# EAGLE design OSO-MISC-20-009 Power Adapter for Sensor Cap (EAGLE 9.4.2)
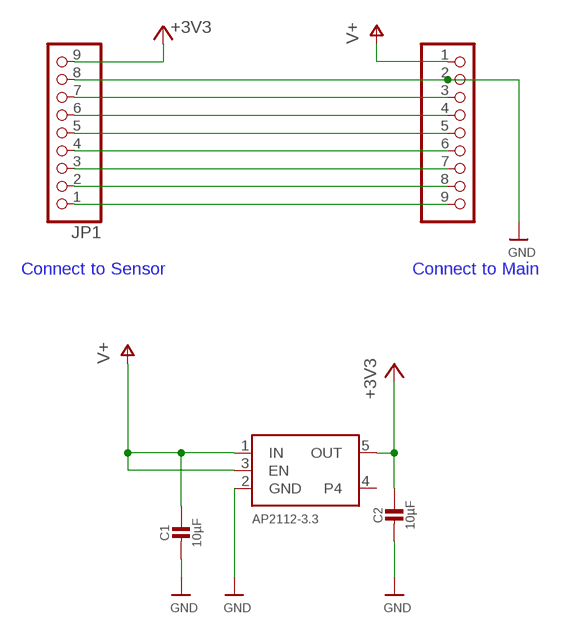
[diagram p0: schematic, sheet 1]

## Parts
C1  10µF  CAP_CERAMIC0805-NOOUTLINE  [0805-NO]
C2  10µF  CAP_CERAMIC0805-NOOUTLINE  [0805-NO]
JP1  HEADER-1X9_JSTSH  [JST_SH9]
JP2  HEADER-1X9_JSTSH  [JST_SH9]
U1  AP2112-3.3  VREG_SOT23-5  [SOT23-5]

## Nets
+3V3 [power]: C2.1 JP1.9 U1.5(OUT)
GND [gnd]: C1.2 C2.2 JP1.8 JP2.2 U1.2(GND)
N$1: JP1.1 JP2.9
N$2: JP1.2 JP2.8
N$3: JP1.3 JP2.7
N$4: JP1.4 JP2.6
N$5: JP1.5 JP2.5
N$6: JP1.6 JP2.4
N$7: JP1.7 JP2.3
V+ [power]: C1.1 JP2.1 U1.1(IN) U1.3(EN)
Unconnected: U1.4

## Notes on the sheet
- Connect to Sensor | Connect to Main

## Library data of the parts
C1 C2 = microbuilder:CAP_CERAMIC: Ceramic Capacitors For new designs, use the packages preceded by an '_' character since they are more reliable: The following footprints should be used on most boards: _0402 - Standard footprint for regular board layouts _0603 - Standard footprint for regular board layouts _0805 - Standard footprint for regular board layouts _1206 - Standard footprint for regular board layouts For extremely tight-pitch boards where space is at a premium, the following 'micro-pitch' footprints can be used (smaller pads, no silkscreen outline, etc.): _0402MP - Micro-pitch footprint for very dense/compact boards _0603MP - Micro-pitch footprint for very dense/compact boards _0805MP - Micro-pitch footprint for very dense/compact boards _1206MP - Micro-pitch footprint for very dense/compact boards
JP1 JP2 = microbuilder:HEADER-1X9: PIN HEADER
U1 = microbuilder:VREG_SOT23-5: SOT23-5 Fixed Voltage Regulators Part Current Out V Out V In V Dropout θJA (°C/W) TJ (°C) Digikey Part No. ADP121 150mA 3.3V 3.4-5.5V 0.09V @ 150mA -- -- ADP121-AUJZ33R7CT-ND ADP121 150mA 3.0V 3.1-5.5V 0.09V @ 150mA -- -- ADP121-AUJZ30R7CT-ND ADP122 300mA 3.3V 3.4-5.5V 0.085V @ 300mA -- -- ADP122AUJZ-3.3-R7CT-ND ADP1712 300mA 3.3V 3.5-5.5V 0.17V @ 300mA -- -- ADP1712AUJZ-3.3-R7TR-ND AP7311 (Low Cost) 150mA 3.3V 3.5-6V 0.15V @ 150mA -- -- AP7311-33WG-7DICT-ND LD39015M18R 150mA 1.8V 1.9V-5.5V 0.08V @ 100mA -- -- 497-6977-1-ND LP2985A-33DBVR 150mA 3.3V 3.3-16V 0.28V @ 150mA 206 150 296-18479-1-ND MCP1824T-3302E/OT 300mA 3.3V 3.5V-6V 0.2V @ 300mA -- -- MCP1824T-3302E/OTCT-ND MIC5205-2.5YM5 TR 150mA 2.5V 2.7-16V 0.165V @ 150mA -- -- 576-1257-2-ND MIC5205-3.0YM5 TR 150mA 3.0V 3.2V-16V 0.165V @ 150mA -- -- 576-1258-2-ND MIC5205-3.3YM5 TR 150mA 3.3V 3.5V-16V 0.165V @ 150mA -- -- 576-1259-2-ND TPS780330220 150mA 3.3V+2.2V 3.6-5.5V 250mV Max -- -- 296-23332-1-ND TDA3663/N1,135 100mA 3.3V 3.5-45V 0.18V @ 50mA -- -- 568-5343-1-ND Max operating temp can be calculated using θJA, TJ (max junction temperature), and power in watts. Set the "Maximum Ambient Temperature" until it reaches TJ ("Max Junction Temperature"), which is the absolute limit for safe use of the regulator: Heat Sink Temperature Calculator <http://www.daycounter.com/Calculators/Heat-Sink-Temperature-Calculator.phtml> For example, With 12V source into a 3.3V LP2985 and a 30mA load, we are dissipating (12V-3.3V) * 0.03A = 0.261W. With a θJA of 206 °C/W, a TJ of 150°C, and 261mW we can safely use the chip without a heat sink up to 75°C (=147.1°C Junction Temperature).

## Net classes
0 default: width 0.152 mm, drill 0.254 mm
1 power: width 0.305 mm, drill 0.305 mm
2 gnd: width 0.305 mm

## Board
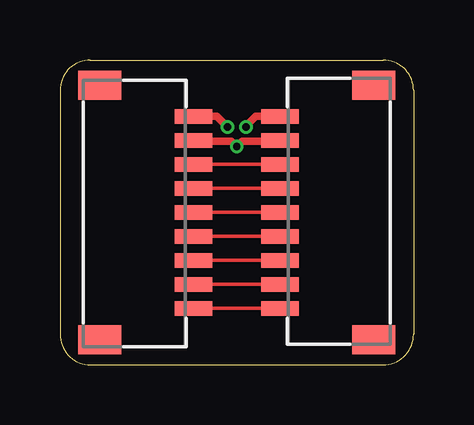
[diagram p1: board, top side]
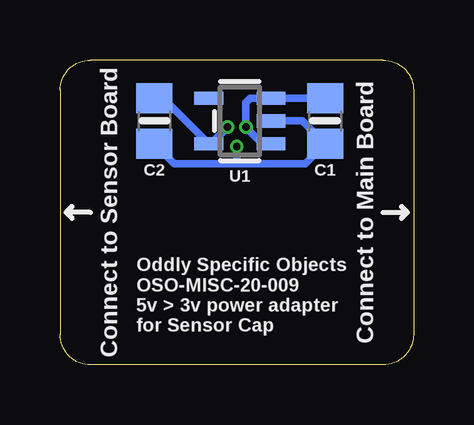
[diagram p2: board, bottom side, seen from below]

Size 14.73 x 12.7 mm. Coordinates in mm from the lower left corner, seen from the top.
Outline: 14.73,11.43 arc90 13.46,12.7 1.27,12.7 arc90 0,11.43 0,1.27 arc90 1.27,0 13.46,0 arc90 14.73,1.27 14.73,11.43
Copper layers (1*16): Top 0.035559375mm / dielectric 1.6mm / Bottom 0.035559375mm
Design rules "oshpark-2layer *": minimum track width 6mil, minimum drill 10mil, track to track 6mil, track to pad 6mil, pad to pad 6mil, via to via 6mil, smd to smd 6mil, copper to edge 15mil, drill to drill 6mil, minimum pad ring 5mil, minimum via ring 5mil, stop-mask expansion 2.5mil, vias tented up to drill 12mil, thermal gap 10mil

### Footprints (pad centres in the part's own frame; a part is rotated, then mirrored left to right if it is on the bottom)
0805-NO = smd 1.24 x 1.5: 1 -0.95,0; 2 0.95,0
JST_SH9 = smd 0.6 x 1.55: 1 -4,2.514; 2 -3,2.514; 3 -2,2.514; 4 -1,2.514; 5 0,2.514; 6 1,2.514; 7 2,2.514; 8 3,2.514; 9 4,2.514 | smd 1.2 x 1.8: MT1 -5.3,-1.386; MT2 5.3,-1.386
SOT23-5 = smd 0.55 x 1.2: 1 -0.95,-1.3; 2 0,-1.3; 3 0.95,-1.3; 4 0.95,1.3; 5 -0.95,1.3

### Placement (x,y rotation side)
C1  3.68,10.16 270 bottom
C2  10.79,10.16 270 bottom
JP1  11.68,6.35 90 top
JP2  3.05,6.35 270 top
U1  7.24,10.16 90 bottom

### Tracks (layer width: path | path; a pad name or v marks a point on that pad's centre or on a via)
+3V3  (via drill 0.3)
  Top 0.305: JP1.9 8.16,10.35 7.75,9.93 v7.75,9.91
  Bottom 0.305: C2.1 10.44,11.11 U1.5 8.44,9.21 v7.75,9.91
GND  (via drill 0.3)
  Top 0.305: JP2.2 5.49,9.35 5.46,9.32 7.14,9.32 v7.37,9.1 7.59,9.32 9.02,9.32 9.04,9.35 JP1.8
  Bottom 0.305: C2.2 9.97,8.38 7.37,8.38 | 7.37,8.38 4.51,8.38 C1.2 4.63,10.16 U1.2 | v7.37,9.1 7.37,8.38
N$1
  Top 0.152: JP1.1 JP2.9
N$2
  Top 0.152: JP2.8 JP1.2
N$3
  Top 0.152: JP1.3 JP2.7
N$4
  Top 0.152: JP2.6 JP1.4
N$5
  Top 0.152: JP1.5 JP2.5
N$6
  Top 0.152: JP2.4 JP1.6
N$7
  Top 0.152: JP2.3 JP1.7
V+  (via drill 0.3)
  Top 0.305: v6.99,9.91 6.54,10.35 JP2.1
  Bottom 0.305: C1.1 U1.3 6.8,11.11 6.99,10.92 v6.99,9.91 6.84,9.77 6.84,9.76 6.29,9.21 U1.1

### Text on the board
bPlace: Connect to Main Board | Connect to Sensor Board | Oddly Specific Objects / OSO-MISC-20-009 / 5v > 3v power adapter / for Sensor Cap